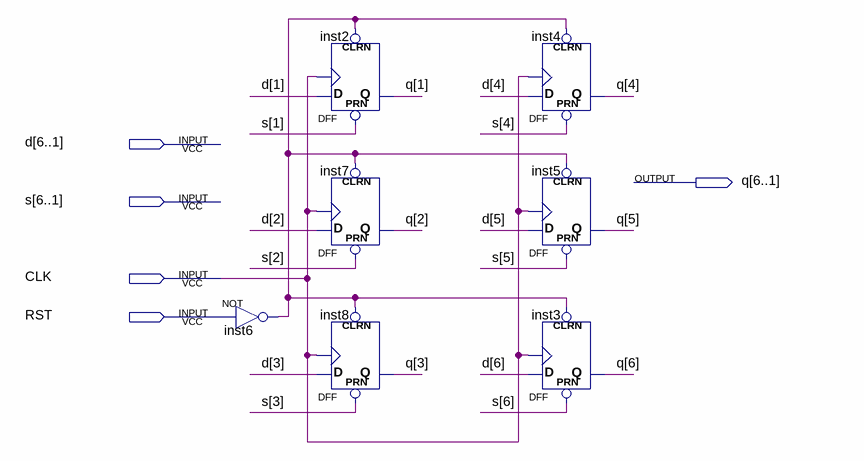
[diagram p0: schematic sheet]
// Quartus schematic uA_reg.bdf as structural Verilog: 7 symbols, 5 pins
module uA_reg (
  input  [6:1] d,
  input  [6:1] s,
  input  CLK,
  input  RST,
  output [6:1] q
);

  wire inst6_out;

  not inst6 (inst6_out, RST);
  DFF inst2 (.CLRN(inst6_out), .CLK(CLK), .D(d[1]), .PRN(s[1]), .Q(q[1]));
  DFF inst7 (.CLRN(inst6_out), .CLK(CLK), .D(d[2]), .PRN(s[2]), .Q(q[2]));
  DFF inst8 (.CLRN(inst6_out), .CLK(CLK), .D(d[3]), .PRN(s[3]), .Q(q[3]));
  DFF inst4 (.CLRN(inst6_out), .CLK(CLK), .D(d[4]), .PRN(s[4]), .Q(q[4]));
  DFF inst5 (.CLRN(inst6_out), .CLK(CLK), .D(d[5]), .PRN(s[5]), .Q(q[5]));
  DFF inst3 (.CLRN(inst6_out), .CLK(CLK), .D(d[6]), .PRN(s[6]), .Q(q[6]));
endmodule
